# Altium schematic sheet Discovery.SchDoc
size A4; Author: Wojciech Grędel; Revision: 1
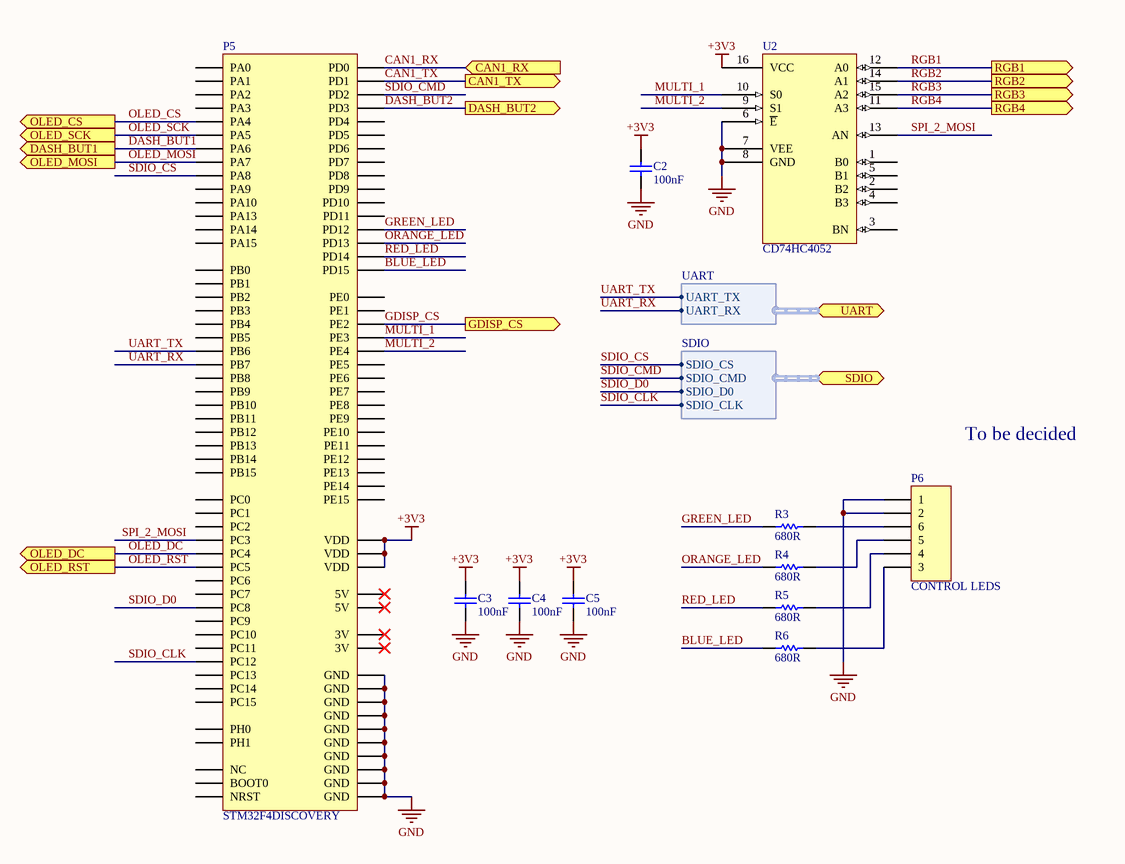
[diagram p0: Discovery.SchDoc]

## Parts
C2  value 100nF  [CAP_0805_IPC_MD]  (hidden comment: Cap)
C3  value 100nF  [CAP_0805_IPC_MD]  (hidden comment: Cap)
C4  value 100nF  [CAP_0805_IPC_MD]  (hidden comment: Cap)
C5  value 100nF  [CAP_0805_IPC_MD]  (hidden comment: Cap)
P5  STM32F4DISCOVERY  [DISCOVERY_F4]
P6  CONTROL LEDS  [HDR_1x6_3_94_LOCKING]
R3  value 680R  [RES_0805_IPC_MD]  (hidden comment: Res)
R4  value 680R  [RES_0805_IPC_MD]  (hidden comment: Res)
R5  value 680R  [RES_0805_IPC_MD]  (hidden comment: Res)
R6  value 680R  [RES_0805_IPC_MD]  (hidden comment: Res)
U2  CD74HC4052  [SO_16_IPC_MD]

## Ports
CAN1_RX (in), CAN1_TX (out), DASH_BUT1 (out), DASH_BUT2 (out), GDISP_CS (out), OLED_CS (out), OLED_DC (out), OLED_MOSI (out), OLED_RST (out), OLED_SCK (out), RGB1 (out), RGB2 (out), RGB3 (out), RGB4 (out), SDIO (harness SDIO), UART (harness UART)

## Harnesses
UART: UART_TX, UART_RX
SDIO: SDIO_CS, SDIO_CMD, SDIO_D0, SDIO_CLK

## Nets
+3V3: C2.2 C3.2 C4.2 C5.2 P5.3(VDD) P5.4(VDD) P5.72(VDD) U2.16(VCC)
GND: C2.1 C3.1 C4.1 C5.1 P5.1(GND) P5.2(GND) P5.5(GND) P5.23(GND) P5.49(GND) P5.50(GND) P5.51(GND) P5.52(GND) P5.99(GND) P5.100(GND) P6.1 P6.2 U2.6(~{E}) U2.7(VEE) U2.8(GND)
BLUE_LED: P5.47(PD15) R6.1
CAN1_RX: P5.86(PD0) ; port CAN1_RX
CAN1_TX: P5.83(PD1) ; port CAN1_TX
DASH_BUT1: P5.18(PA6) ; port DASH_BUT1
DASH_BUT2: P5.81(PD3) ; port DASH_BUT2
GDISP_CS: P5.65(PE2) ; port GDISP_CS
GREEN_LED: P5.44(PD12) R3.1
MULTI_1: P5.66(PE3) U2.10(S0)
MULTI_2: P5.63(PE4) U2.9(S1)
OLED_CS: P5.16(PA4) ; port OLED_CS
OLED_DC: P5.20(PC4) ; port OLED_DC
OLED_MOSI: P5.17(PA7) ; port OLED_MOSI
OLED_RST: P5.19(PC5) ; port OLED_RST
OLED_SCK: P5.15(PA5) ; port OLED_SCK
ORANGE_LED: P5.45(PD13) R4.1
RED_LED: P5.46(PD14) R5.1
RGB1: U2.12(A0) ; port RGB1
RGB2: U2.14(A1) ; port RGB2
RGB3: U2.15(A2) ; port RGB3
RGB4: U2.11(A3) ; port RGB4
SDIO_CLK: P5.85(PC12) ; port SDIO.SDIO_CLK
SDIO_CMD: P5.84(PD2) ; port SDIO.SDIO_CMD
SDIO_CS: P5.93(PA8) ; port SDIO.SDIO_CS
SDIO_D0: P5.95(PC8) ; port SDIO.SDIO_D0
SPI_2_MOSI: P5.9(PC3) U2.13(AN)
UART_RX: P5.74(PB7) ; port UART.UART_RX
UART_TX: P5.73(PB6) ; port UART.UART_TX
NetP6_3: P6.3 R6.2
NetP6_4: P6.4 R5.2
NetP6_5: P6.5 R4.2
NetP6_6: P6.6 R3.2

Not connected (* = marked no-connect by the designer): P5 6(NRST) 7(PC1) 8(PC0) 10(PC2) 11(PA1) 12(PA0) 13(PA3) 14(PA2) 21(PB1) 22(PB0) 24(PB2) 25(PE7) 26(PE8) 27(PE9) 28(PE10) 29(PE11) 30(PE12) 31(PE13) 32(PE14) 33(PE15) 34(PB10) 35(PB11) 36(PB12) 37(PB13) 38(PB14) 39(PB15) 40(PD8) 41(PD9) 42(PD10) 43(PD11) 48(NC) 53(5V)* 54(5V)* 55(3V)* 56(3V)* 57(PH0) 58(PH1) 59(PC14) 60(PC15) 61(PE6) 62(PC13) 64(PE5) 67(PE0) 68(PE1) 69(PB8) 70(PB9) 71(BOOT0) 75(PB4) 76(PB5) 77(PD7) 78(PB3) 79(PD5) 80(PD6) 82(PD4) 87(PC10) 88(PC11) 89(PA14) 90(PA15) 91(PA10) 92(PA13) 94(PA9) 96(PC9) 97(PC6) 98(PC7); U2 1(B0) 2(B2) 3(BN) 4(B3) 5(B1)

## Notes on the sheet
- To be decided
- Confidential / Not for distribution !
- Project name:
- Document name:
- Designer Name:
- Date/Time:
- Revision:

## Library data of the parts
C2-C5 = Cap: Capacitor; Manufacturer: Samsung; Supplier Part Number: CL21B104KBCNNNC; Supplier: TME
P5 = STM32F4DISCOVERY: STM32F4DISCOVERY connector for shield; LatestRevisionDate: 16-Apr-2016; Publisher: Wojciech Grędel
P6 = Header 6: Header, 6-Pin; Manufacturer: Joint Tech; LatestRevisionDate: 17-Jul-2002; LatestRevisionNote: Re-released for DXP Platform.; Publisher: Altium Limited; Supplier: TME; Supplier Part Number: A3960WV-06P
R3-R6 = Res: Resistor; Supplier: *; Supplier Part Number: *; Manufacturer: *
U2 = CD74HC4052: MUX/DEMUX; Supplier: *; Manufacturer: *; Supplier Part Number: *